# EAGLE schematic rambank (EAGLE 7.3.0)
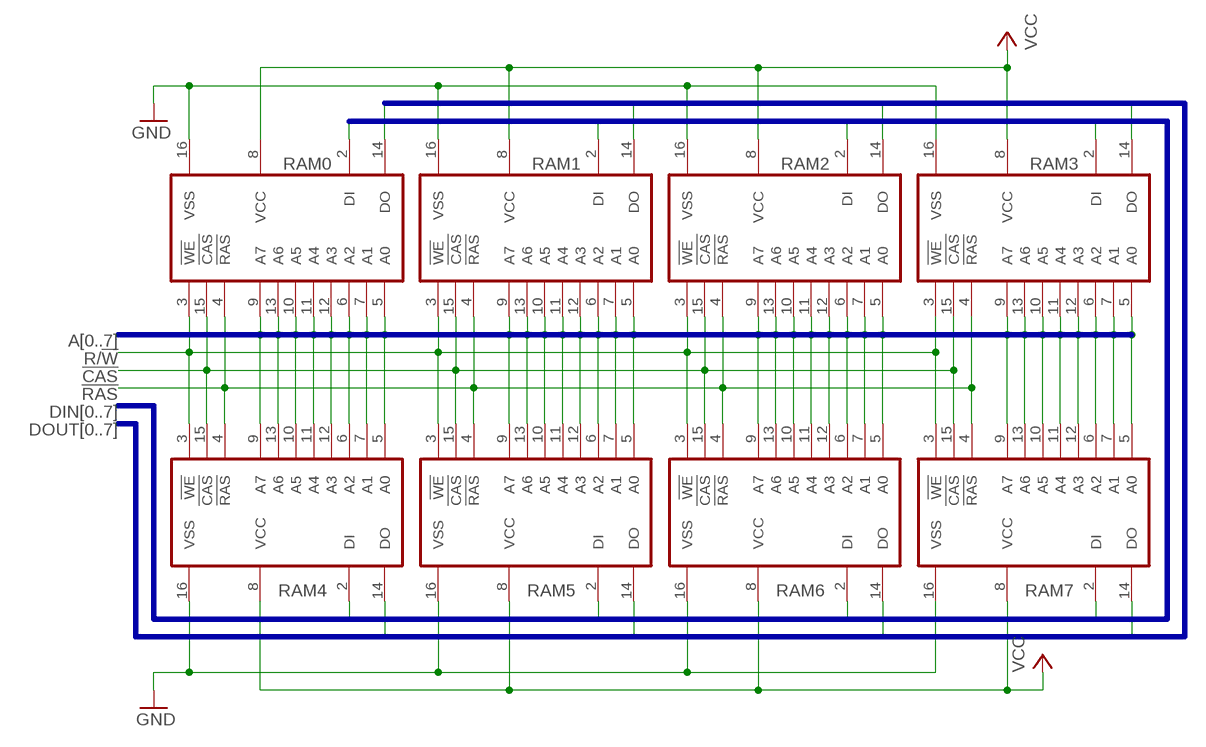
[diagram p0: schematic, sheet 1]

## Parts
RAM0  2164  [DIL16]
RAM1  2164  [DIL16]
RAM2  2164  [DIL16]
RAM3  2164  [DIL16]
RAM4  2164  [DIL16]
RAM5  2164  [DIL16]
RAM6  2164  [DIL16]
RAM7  2164  [DIL16]

## Nets
!CAS!: RAM0.15(!CAS) RAM1.15(!CAS) RAM2.15(!CAS) RAM3.15(!CAS) RAM4.15(!CAS) RAM5.15(!CAS) RAM6.15(!CAS) RAM7.15(!CAS)
!RAS!: RAM0.4(!RAS) RAM1.4(!RAS) RAM2.4(!RAS) RAM3.4(!RAS) RAM4.4(!RAS) RAM5.4(!RAS) RAM6.4(!RAS) RAM7.4(!RAS)
A0: RAM0.5(A0) RAM1.5(A0) RAM2.5(A0) RAM3.5(A0) RAM4.5(A0) RAM5.5(A0) RAM6.5(A0) RAM7.5(A0)
A1: RAM0.7(A1) RAM1.7(A1) RAM2.7(A1) RAM3.7(A1) RAM4.7(A1) RAM5.7(A1) RAM6.7(A1) RAM7.7(A1)
A2: RAM0.6(A2) RAM1.6(A2) RAM2.6(A2) RAM3.6(A2) RAM4.6(A2) RAM5.6(A2) RAM6.6(A2) RAM7.6(A2)
A3: RAM0.12(A3) RAM1.12(A3) RAM2.12(A3) RAM3.12(A3) RAM4.12(A3) RAM5.12(A3) RAM6.12(A3) RAM7.12(A3)
A4: RAM0.11(A4) RAM1.11(A4) RAM2.11(A4) RAM3.11(A4) RAM4.11(A4) RAM5.11(A4) RAM6.11(A4) RAM7.11(A4)
A5: RAM0.10(A5) RAM1.10(A5) RAM2.10(A5) RAM3.10(A5) RAM4.10(A5) RAM5.10(A5) RAM6.10(A5) RAM7.10(A5)
A6: RAM0.13(A6) RAM1.13(A6) RAM2.13(A6) RAM3.13(A6) RAM4.13(A6) RAM5.13(A6) RAM6.13(A6) RAM7.13(A6)
A7: RAM0.9(A7) RAM1.9(A7) RAM2.9(A7) RAM3.9(A7) RAM4.9(A7) RAM5.9(A7) RAM6.9(A7) RAM7.9(A7)
DIN0: RAM0.2(DI)
DIN1: RAM1.2(DI)
DIN2: RAM2.2(DI)
DIN3: RAM3.2(DI)
DIN4: RAM4.2(DI)
DIN5: RAM5.2(DI)
DIN6: RAM6.2(DI)
DIN7: RAM7.2(DI)
DOUT0: RAM0.14(DO)
DOUT1: RAM1.14(DO)
DOUT2: RAM2.14(DO)
DOUT3: RAM3.14(DO)
DOUT4: RAM4.14(DO)
DOUT5: RAM5.14(DO)
DOUT6: RAM6.14(DO)
DOUT7: RAM7.14(DO)
GND: RAM0.16(VSS) RAM1.16(VSS) RAM2.16(VSS) RAM3.16(VSS) RAM4.16(VSS) RAM5.16(VSS) RAM6.16(VSS) RAM7.16(VSS)
R/!W!: RAM0.3(!WE) RAM1.3(!WE) RAM2.3(!WE) RAM3.3(!WE) RAM4.3(!WE) RAM5.3(!WE) RAM6.3(!WE) RAM7.3(!WE)
VCC: RAM0.8(VCC) RAM1.8(VCC) RAM2.8(VCC) RAM3.8(VCC) RAM4.8(VCC) RAM5.8(VCC) RAM6.8(VCC) RAM7.8(VCC)

## Buses
A[0..7]
DIN[0..7]
DOUT[0..7]

## Library data of the parts
RAM0 RAM1-RAM7 = memory:2164: MEMORY